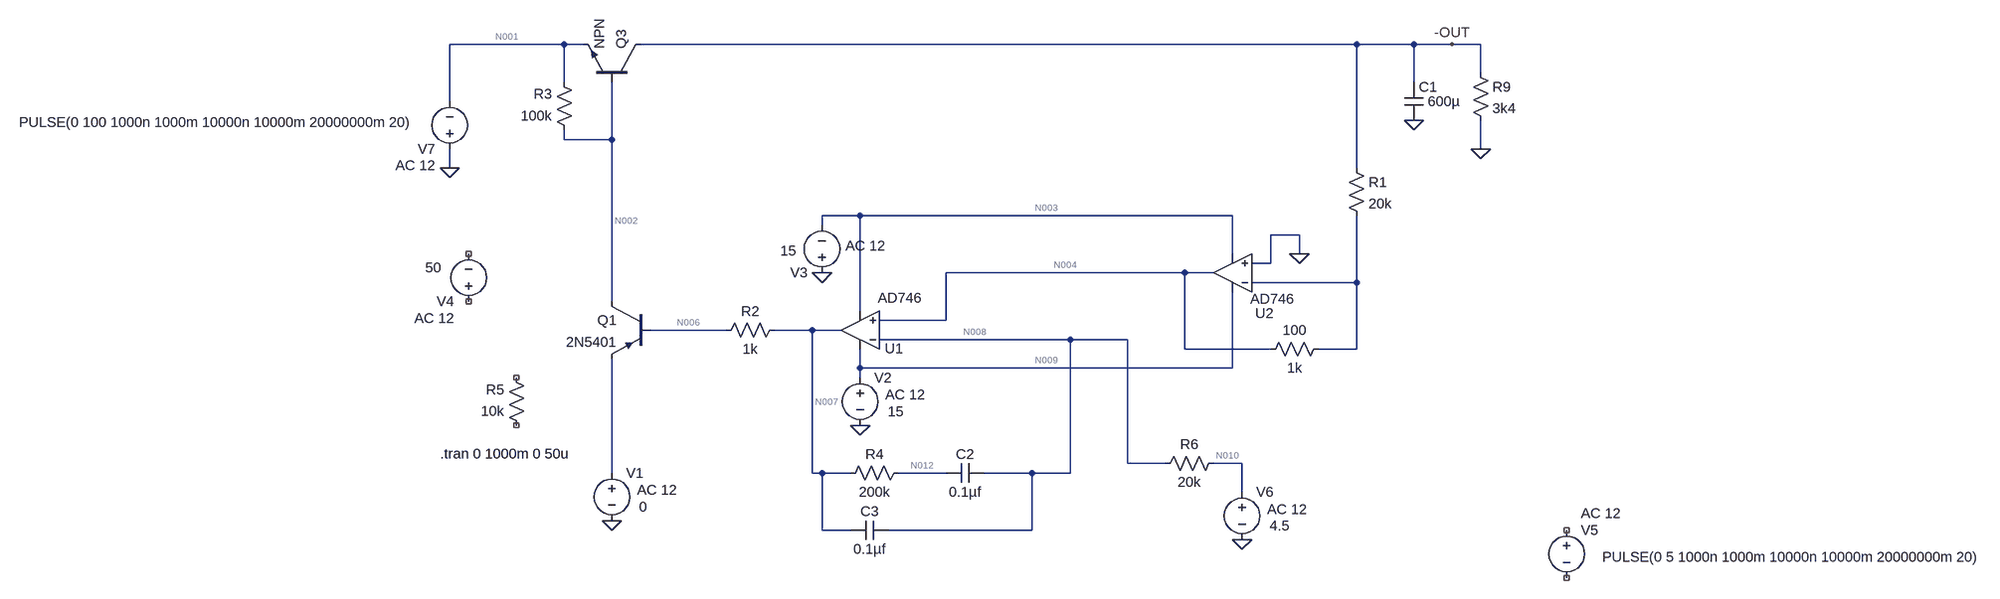
[diagram p0: schematic HV_Reg_Negative 3.asc]
HV_Reg_Negative 3.asc, the LTspice schematic file:
Version 4
SHEET 1 1556 680
WIRE -864 -496 -1056 -496
WIRE -832 -496 -864 -496
WIRE 464 -496 -736 -496
WIRE 560 -496 464 -496
WIRE 624 -496 560 -496
WIRE 672 -496 624 -496
WIRE 672 -448 672 -496
WIRE -864 -432 -864 -496
WIRE 560 -432 560 -496
WIRE -1056 -400 -1056 -496
WIRE -864 -336 -864 -352
WIRE -784 -336 -784 -432
WIRE -784 -336 -864 -336
WIRE 672 -320 672 -368
WIRE -1056 -288 -1056 -320
WIRE 464 -288 464 -496
WIRE -368 -208 -432 -208
WIRE 256 -208 -368 -208
WIRE -432 -192 -432 -208
WIRE 368 -176 320 -176
WIRE 256 -144 256 -208
WIRE 368 -144 368 -176
WIRE 320 -128 320 -176
WIRE 320 -128 288 -128
WIRE 176 -112 -224 -112
WIRE 224 -112 176 -112
WIRE 464 -96 464 -208
WIRE 464 -96 288 -96
WIRE -784 -64 -784 -336
WIRE -368 -48 -368 -208
WIRE -224 -32 -224 -112
WIRE -224 -32 -336 -32
WIRE -592 -16 -720 -16
WIRE -448 -16 -512 -16
WIRE -400 -16 -448 -16
WIRE -16 0 -336 0
WIRE 80 0 -16 0
WIRE 176 16 176 -112
WIRE 320 16 176 16
WIRE 464 16 464 -96
WIRE 464 16 400 16
WIRE -368 48 -368 16
WIRE 256 48 256 -80
WIRE 256 48 -368 48
WIRE -368 64 -368 48
WIRE 80 208 80 0
WIRE 144 208 80 208
WIRE 272 208 224 208
WIRE -784 224 -784 32
WIRE -448 224 -448 -16
WIRE -432 224 -448 224
WIRE -384 224 -432 224
WIRE -224 224 -304 224
WIRE -80 224 -160 224
WIRE -16 224 -16 0
WIRE -16 224 -80 224
WIRE 272 256 272 208
WIRE -432 320 -432 224
WIRE -384 320 -432 320
WIRE -80 320 -80 224
WIRE -80 320 -320 320
FLAG 624 -496 -OUT
FLAG 560 -368 0
FLAG 672 -320 0
FLAG -1056 -288 0
FLAG -368 144 0
FLAG -432 -112 0
FLAG 272 336 0
FLAG 368 -144 0
FLAG -784 304 0
SYMBOL pnp -720 -64 M0
SYMATTR InstName Q1
SYMATTR Value 2N5401
SYMBOL cap 544 -432 R0
WINDOW 3 39 32 Left 2
SYMATTR Value 600µ
SYMATTR InstName C1
SYMBOL res 656 -464 R0
SYMATTR InstName R9
SYMATTR Value 3k4
SYMBOL res 448 -304 R0
SYMATTR InstName R1
SYMATTR Value 20k
SYMBOL res -848 -336 R180
WINDOW 0 36 76 Left 2
WINDOW 3 36 40 Left 2
SYMATTR InstName R3
SYMATTR Value 100k
SYMBOL OpAmps\\AD746 -368 48 R180
WINDOW 0 -72 33 Left 2
WINDOW 3 -103 118 Left 2
SYMATTR InstName U1
SYMBOL voltage -368 48 R0
WINDOW 123 42 45 Left 2
WINDOW 39 0 0 Left 2
WINDOW 3 46 73 Left 2
SYMATTR Value2 AC 12
SYMATTR Value 15
SYMATTR InstName V2
SYMBOL voltage -432 -96 R180
WINDOW 123 -106 61 Left 2
WINDOW 39 0 0 Left 2
WINDOW 3 43 53 Left 2
SYMATTR Value2 AC 12
SYMATTR Value 15
SYMATTR InstName V3
SYMBOL res -288 208 R90
WINDOW 0 0 56 VBottom 2
WINDOW 3 32 56 VTop 2
SYMATTR InstName R4
SYMATTR Value 200k
SYMBOL voltage -1024 -48 R180
WINDOW 123 24 -12 Left 2
WINDOW 39 0 0 Left 2
WINDOW 3 46 73 Left 2
SYMATTR Value2 AC 12
SYMATTR Value 50
SYMATTR InstName V4
SYMBOL cap -320 304 R90
WINDOW 0 0 32 VBottom 2
WINDOW 3 32 32 VTop 2
SYMATTR InstName C3
SYMATTR Value 0.1µf
SYMBOL res -928 160 R180
WINDOW 0 36 76 Left 2
WINDOW 3 36 40 Left 2
SYMATTR InstName R5
SYMATTR Value 10k
SYMBOL npn -736 -432 M270
SYMATTR InstName Q3
SYMBOL voltage 816 304 R0
WINDOW 123 24 -12 Left 2
WINDOW 39 0 0 Left 2
WINDOW 3 60 61 Left 2
SYMATTR Value2 AC 12
SYMATTR Value PULSE(0 5 1000n 1000m 10000n 10000m 20000000m 20)
SYMATTR InstName V5
SYMBOL res 240 192 R90
WINDOW 0 0 56 VBottom 2
WINDOW 3 32 56 VTop 2
SYMATTR InstName R6
SYMATTR Value 20k
SYMBOL OpAmps\\AD746 256 -48 R180
WINDOW 0 -69 -4 Left 2
WINDOW 3 -103 20 Left 2
SYMATTR InstName U2
SYMBOL res 416 0 R90
WINDOW 0 0 56 VBottom 2
WINDOW 3 32 56 VTop 2
SYMATTR InstName 100
SYMATTR Value 1k
SYMBOL cap -160 208 R90
WINDOW 0 0 32 VBottom 2
WINDOW 3 32 32 VTop 2
SYMATTR InstName C2
SYMATTR Value 0.1µf
SYMBOL res -608 0 R270
WINDOW 0 32 56 VTop 2
WINDOW 3 0 56 VBottom 2
SYMATTR InstName R2
SYMATTR Value 1k
SYMBOL voltage -784 208 R0
WINDOW 123 42 45 Left 2
WINDOW 39 0 0 Left 2
WINDOW 3 46 73 Left 2
SYMATTR Value2 AC 12
SYMATTR Value 0
SYMATTR InstName V1
SYMBOL voltage 272 240 R0
WINDOW 123 42 45 Left 2
WINDOW 39 0 0 Left 2
WINDOW 3 46 73 Left 2
SYMATTR Value2 AC 12
SYMATTR Value 4.5
SYMATTR InstName V6
SYMBOL voltage -1056 -304 R180
WINDOW 123 24 -12 Left 2
WINDOW 39 0 0 Left 2
WINDOW 3 60 61 Left 2
SYMATTR Value2 AC 12
SYMATTR Value PULSE(0 100 1000n 1000m 10000n 10000m 20000000m 20)
SYMATTR InstName V7
TEXT -1072 192 Left 2 !.tran 0 1000m 0 50u

The netlist it stands for:
* HV_Reg_Negative 3.asc
Q1 N002 N006 N011 0 2N5401
C1 -OUT 0 600µ
R9 -OUT 0 3k4
R1 -OUT N005 20k
R3 N002 N001 100k
XU1 N004 N008 N009 N003 N007 AD746  ; pins In+ In- V+ V- OUT
V2 N009 0 15 AC 12
V3 0 N003 15 AC 12
R4 N012 N007 200k
V4 NC_01 NC_02 50 AC 12
C3 N008 N007 0.1µf
R5 NC_03 NC_04 10k
Q3 -OUT N002 N001 0 NPN
V5 NC_05 NC_06 PULSE(0 5 1000n 1000m 10000n 10000m 20000000m 20) AC 12
R6 N010 N008 20k
XU2 0 N005 N009 N003 N004 AD746  ; pins In+ In- V+ V- OUT
R§100 N005 N004 1k
C2 N008 N012 0.1µf
R2 N006 N007 1k
V1 N011 0 0 AC 12
V6 N010 0 4.5 AC 12
V7 0 N001 PULSE(0 100 1000n 1000m 10000n 10000m 20000000m 20) AC 12
.model NPN NPN
.model PNP PNP
.lib standard.bjt
.tran 0 1000m 0 50u
.backanno
.end

* Results of the author's LTspice run, read from the files saved beside the schematic
* Operating Point, zero values left out:
*   V(n002) = -7.643 mV
*   V(n006) = -861.9 mV
*   V(n008) = 4.5 V
*   V(n004) = 110 nV
*   V(n009) = 15 V
*   V(n007) = -13.03 V
*   V(n003) = -15 V
*   V(n012) = -13.03 V
*   V(n010) = 4.5 V
*   Ic(Q1) = 76.43 nA
*   Ib(Q1) = -12.17 mA
*   Ie(Q1) = 12.17 mA
*   I(R3) = -76.43 nA
*   I(R6) = 254 pA
*   I(100) = -110 pA
*   I(R2) = 12.17 mA
*   I(V2) = -9.572 mA
*   I(V3) = -21.62 mA
*   I(V1) = -12.17 mA
*   I(V6) = -254 pA
*   I(V7) = 76.43 nA
*   Ix(u1:1) = 110 pA
*   Ix(u1:2) = 254 pA
*   Ix(u1:3) = 4.673 mA
*   Ix(u1:4) = -16.72 mA
*   Ix(u1:5) = 12.17 mA
*   Ix(u2:1) = 110 pA
*   Ix(u2:2) = 110 pA
*   Ix(u2:3) = 4.899 mA
*   Ix(u2:4) = -4.899 mA
*   Ix(u2:5) = -220 pA
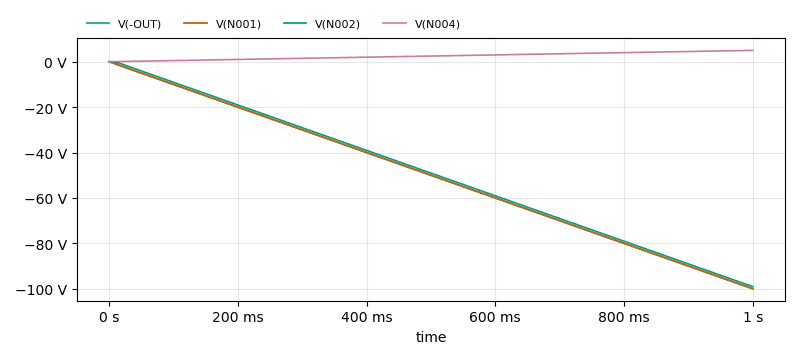
[diagram p1: Transient Analysis of HV_Reg_Negative 3.asc, plotted from the saved traces]
* Transient Analysis, 1 run:
*   V(-OUT): min -99.98 V, max 0 V, average -49.98 V, rms 57.74 V, last -99.98 V
*   V(N001): min -100 V, max 0 V, average -50 V, rms 57.75 V, last -100 V
*   V(N002): min -99.05 V, max -7.643 mV, average -49.04 V, rms 56.92 V, last -99.05 V
*   V(N004): min 0 V, max 4.999 V, average 2.499 V, rms 2.887 V, last 4.999 V